# EAGLE schematic p8x-io-card (EAGLE 9.6.2)
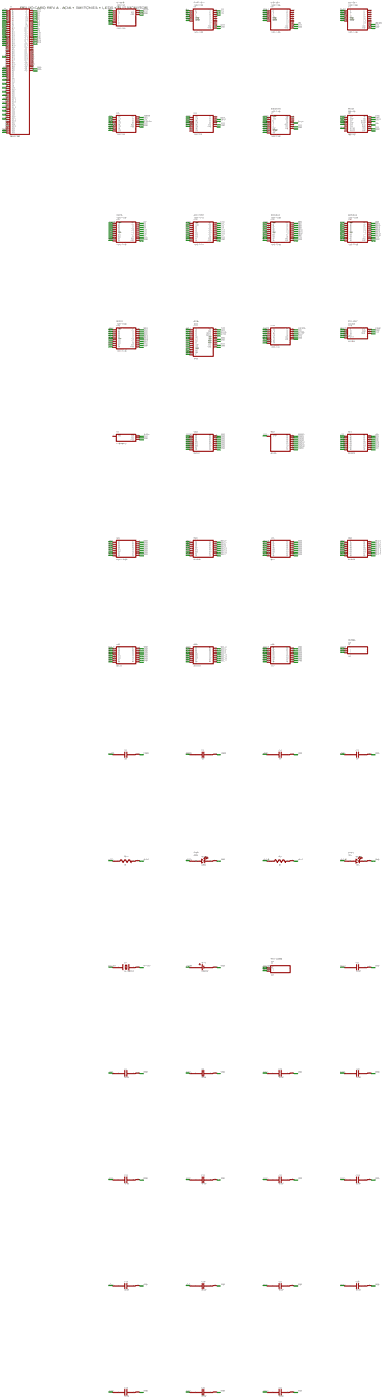
[diagram p0: schematic, sheet 1, overview]
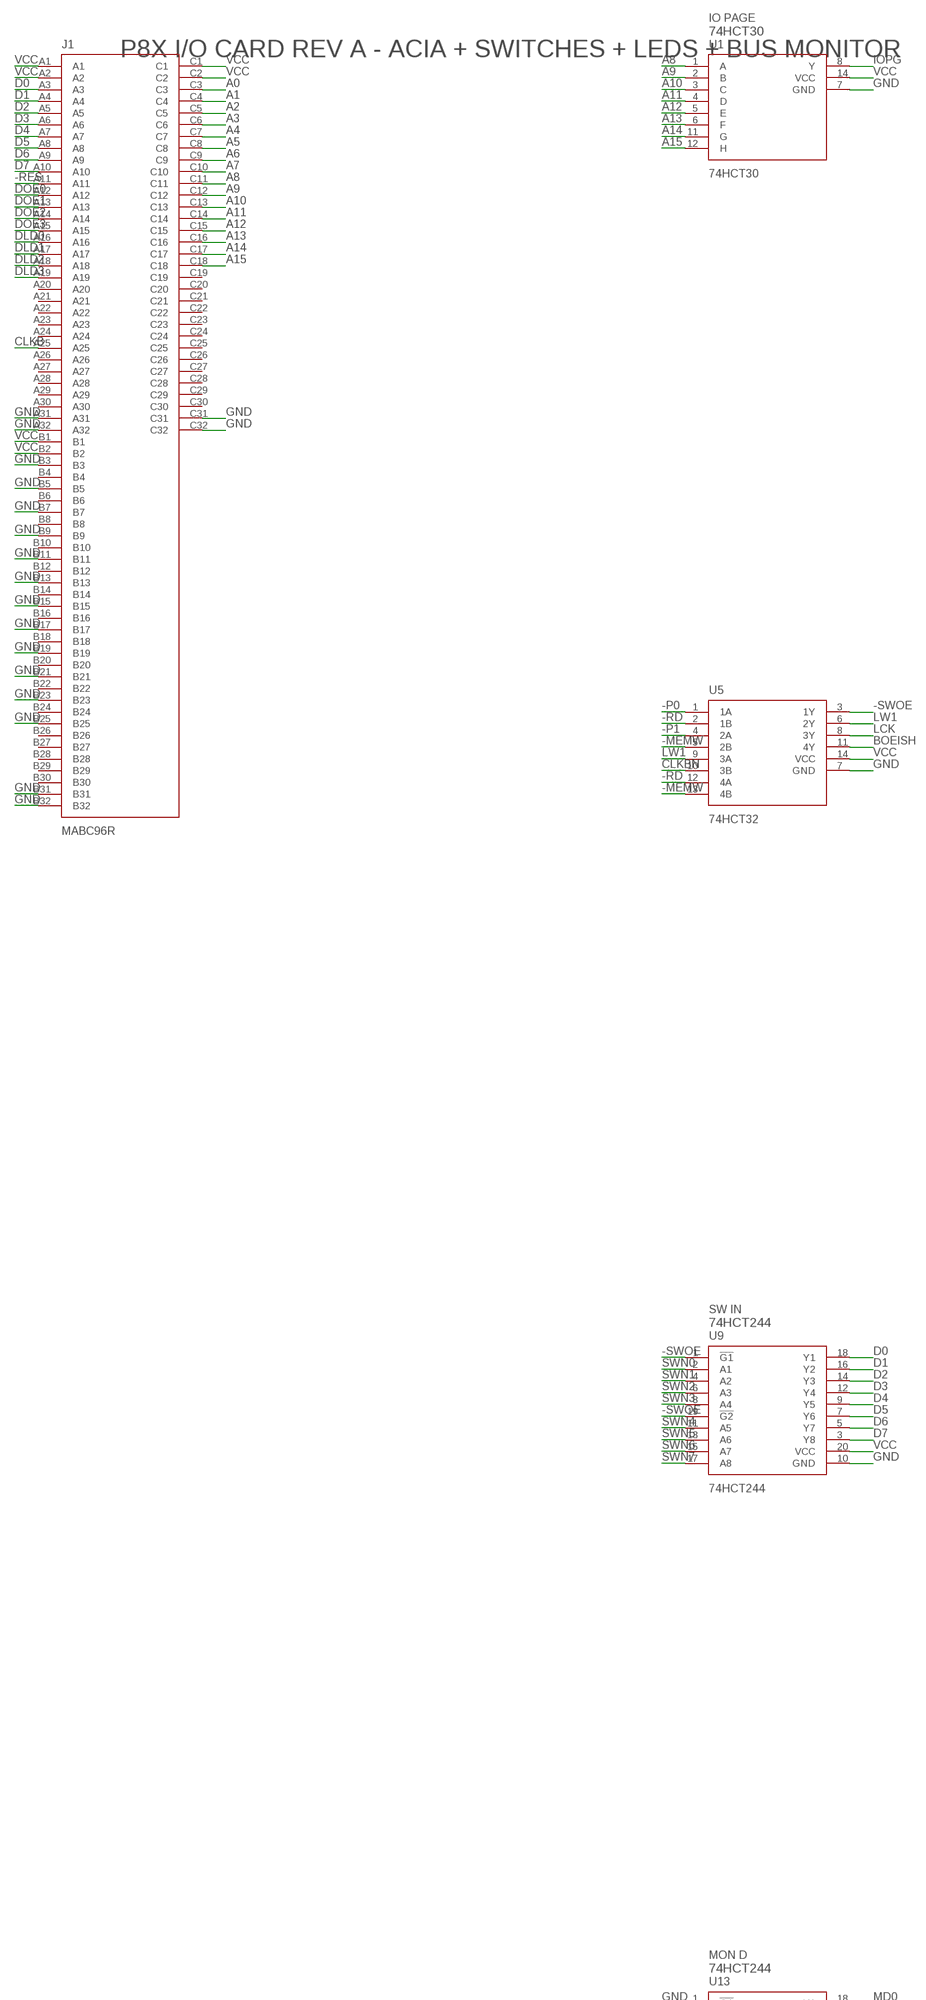
[diagram p1: schematic, sheet 1, part 1 of 5]
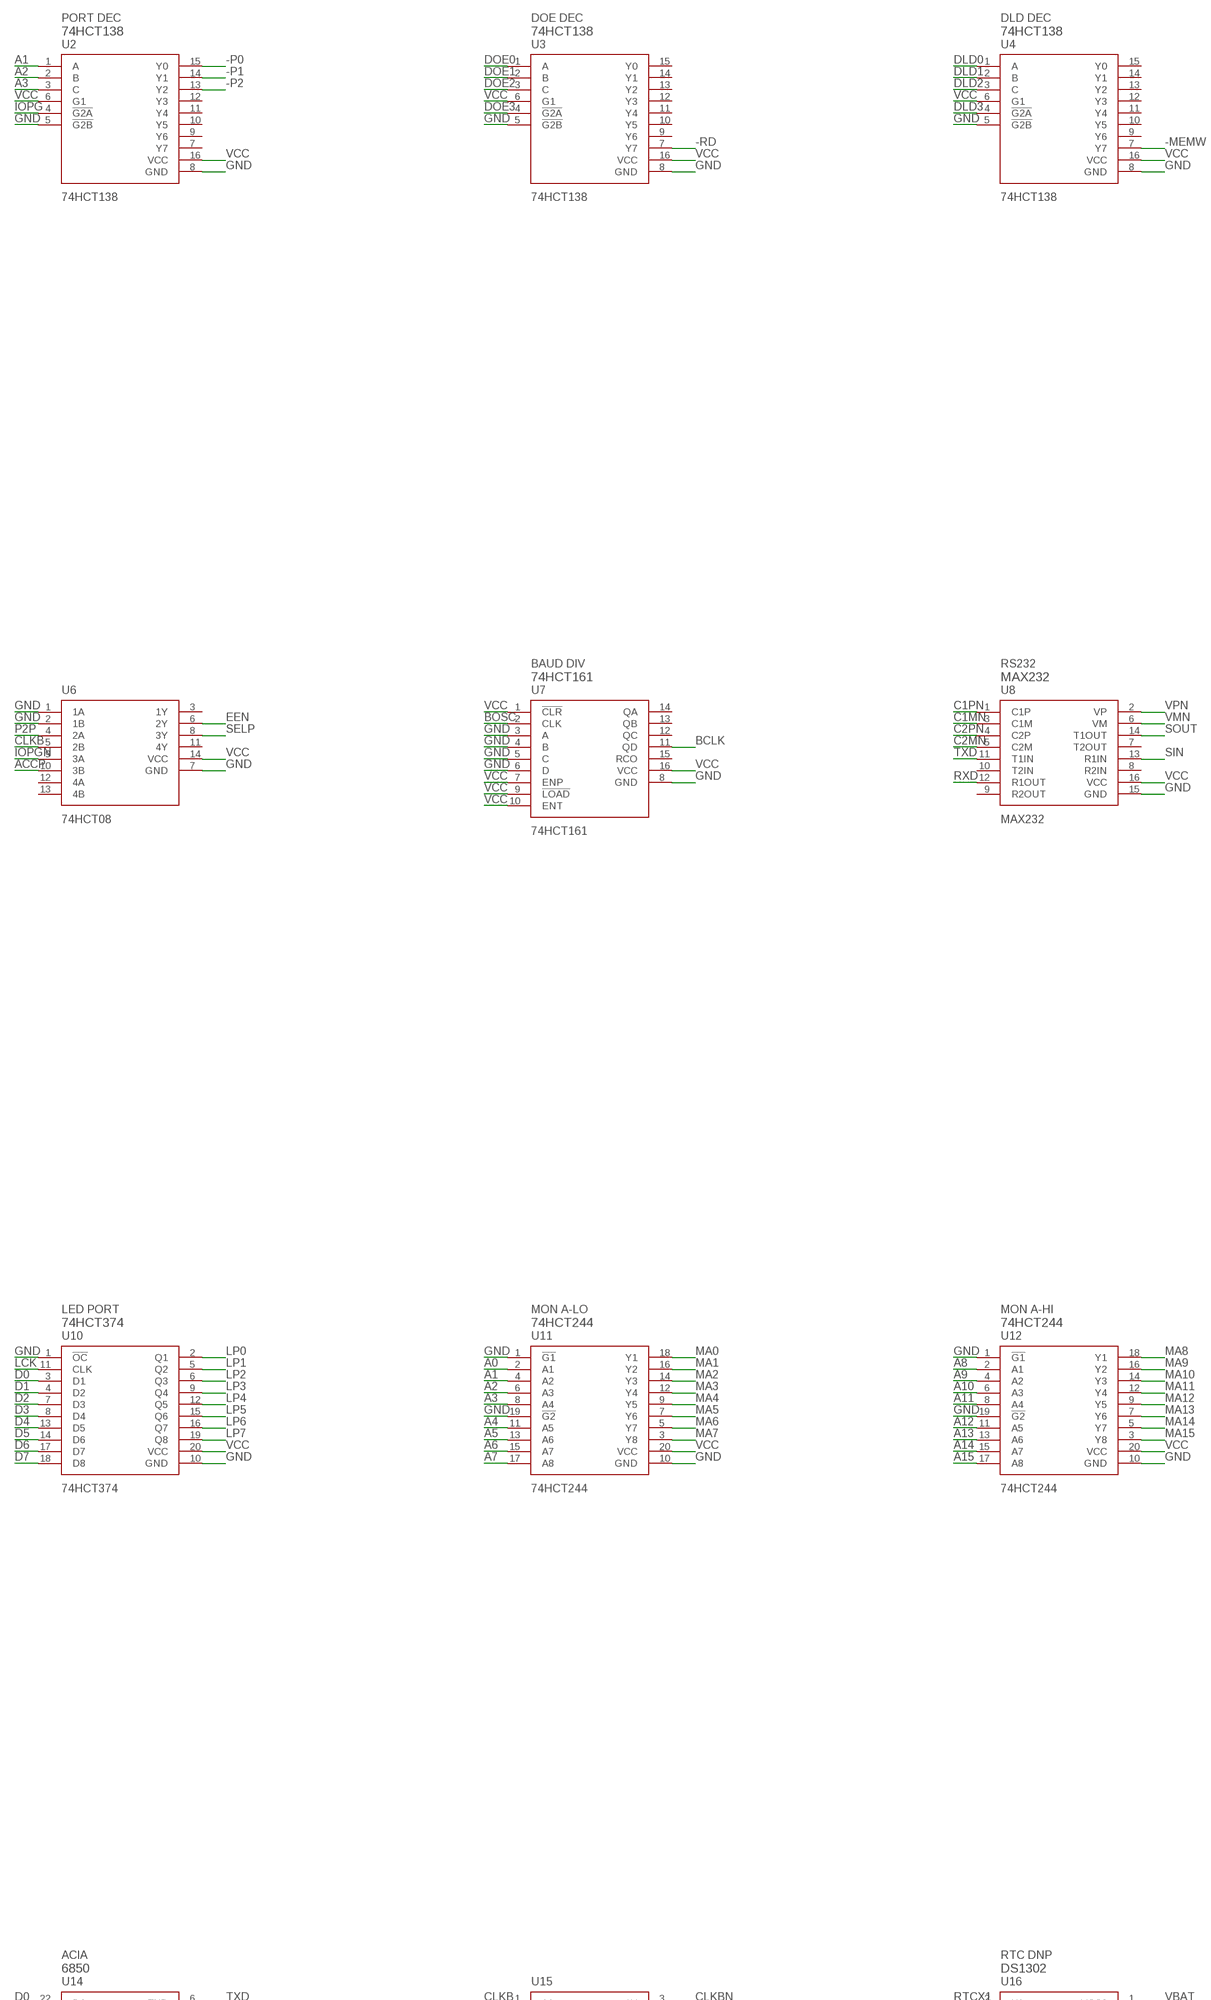
[diagram p2: schematic, sheet 1, part 2 of 5]
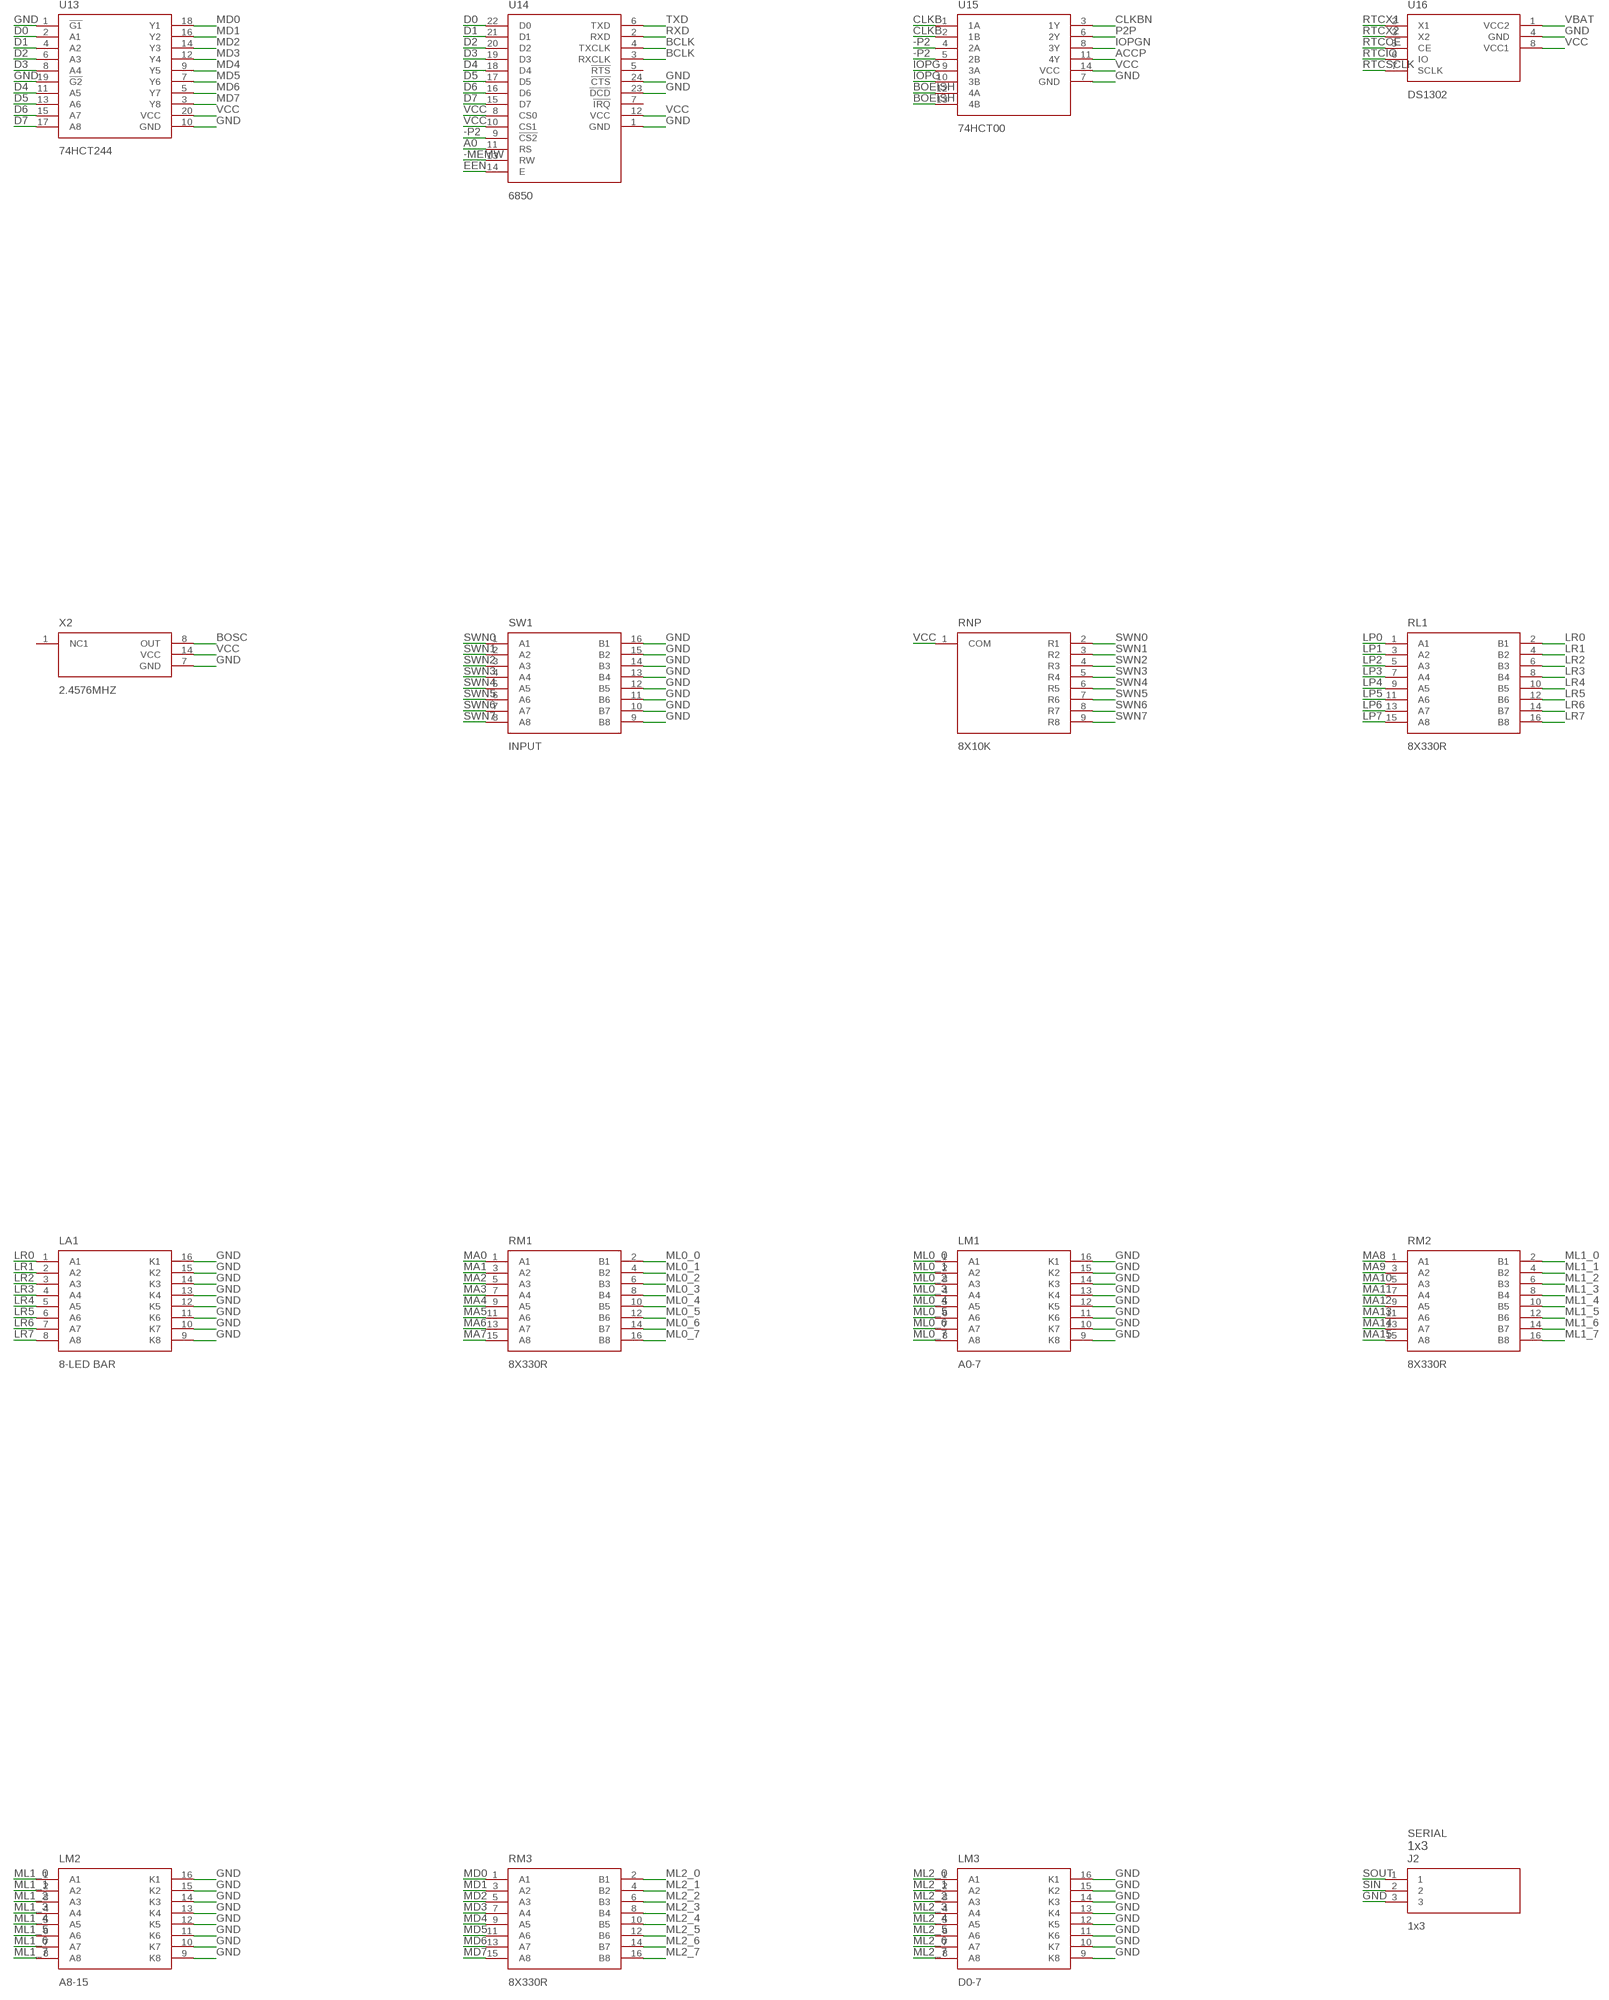
[diagram p3: schematic, sheet 1, part 3 of 5]
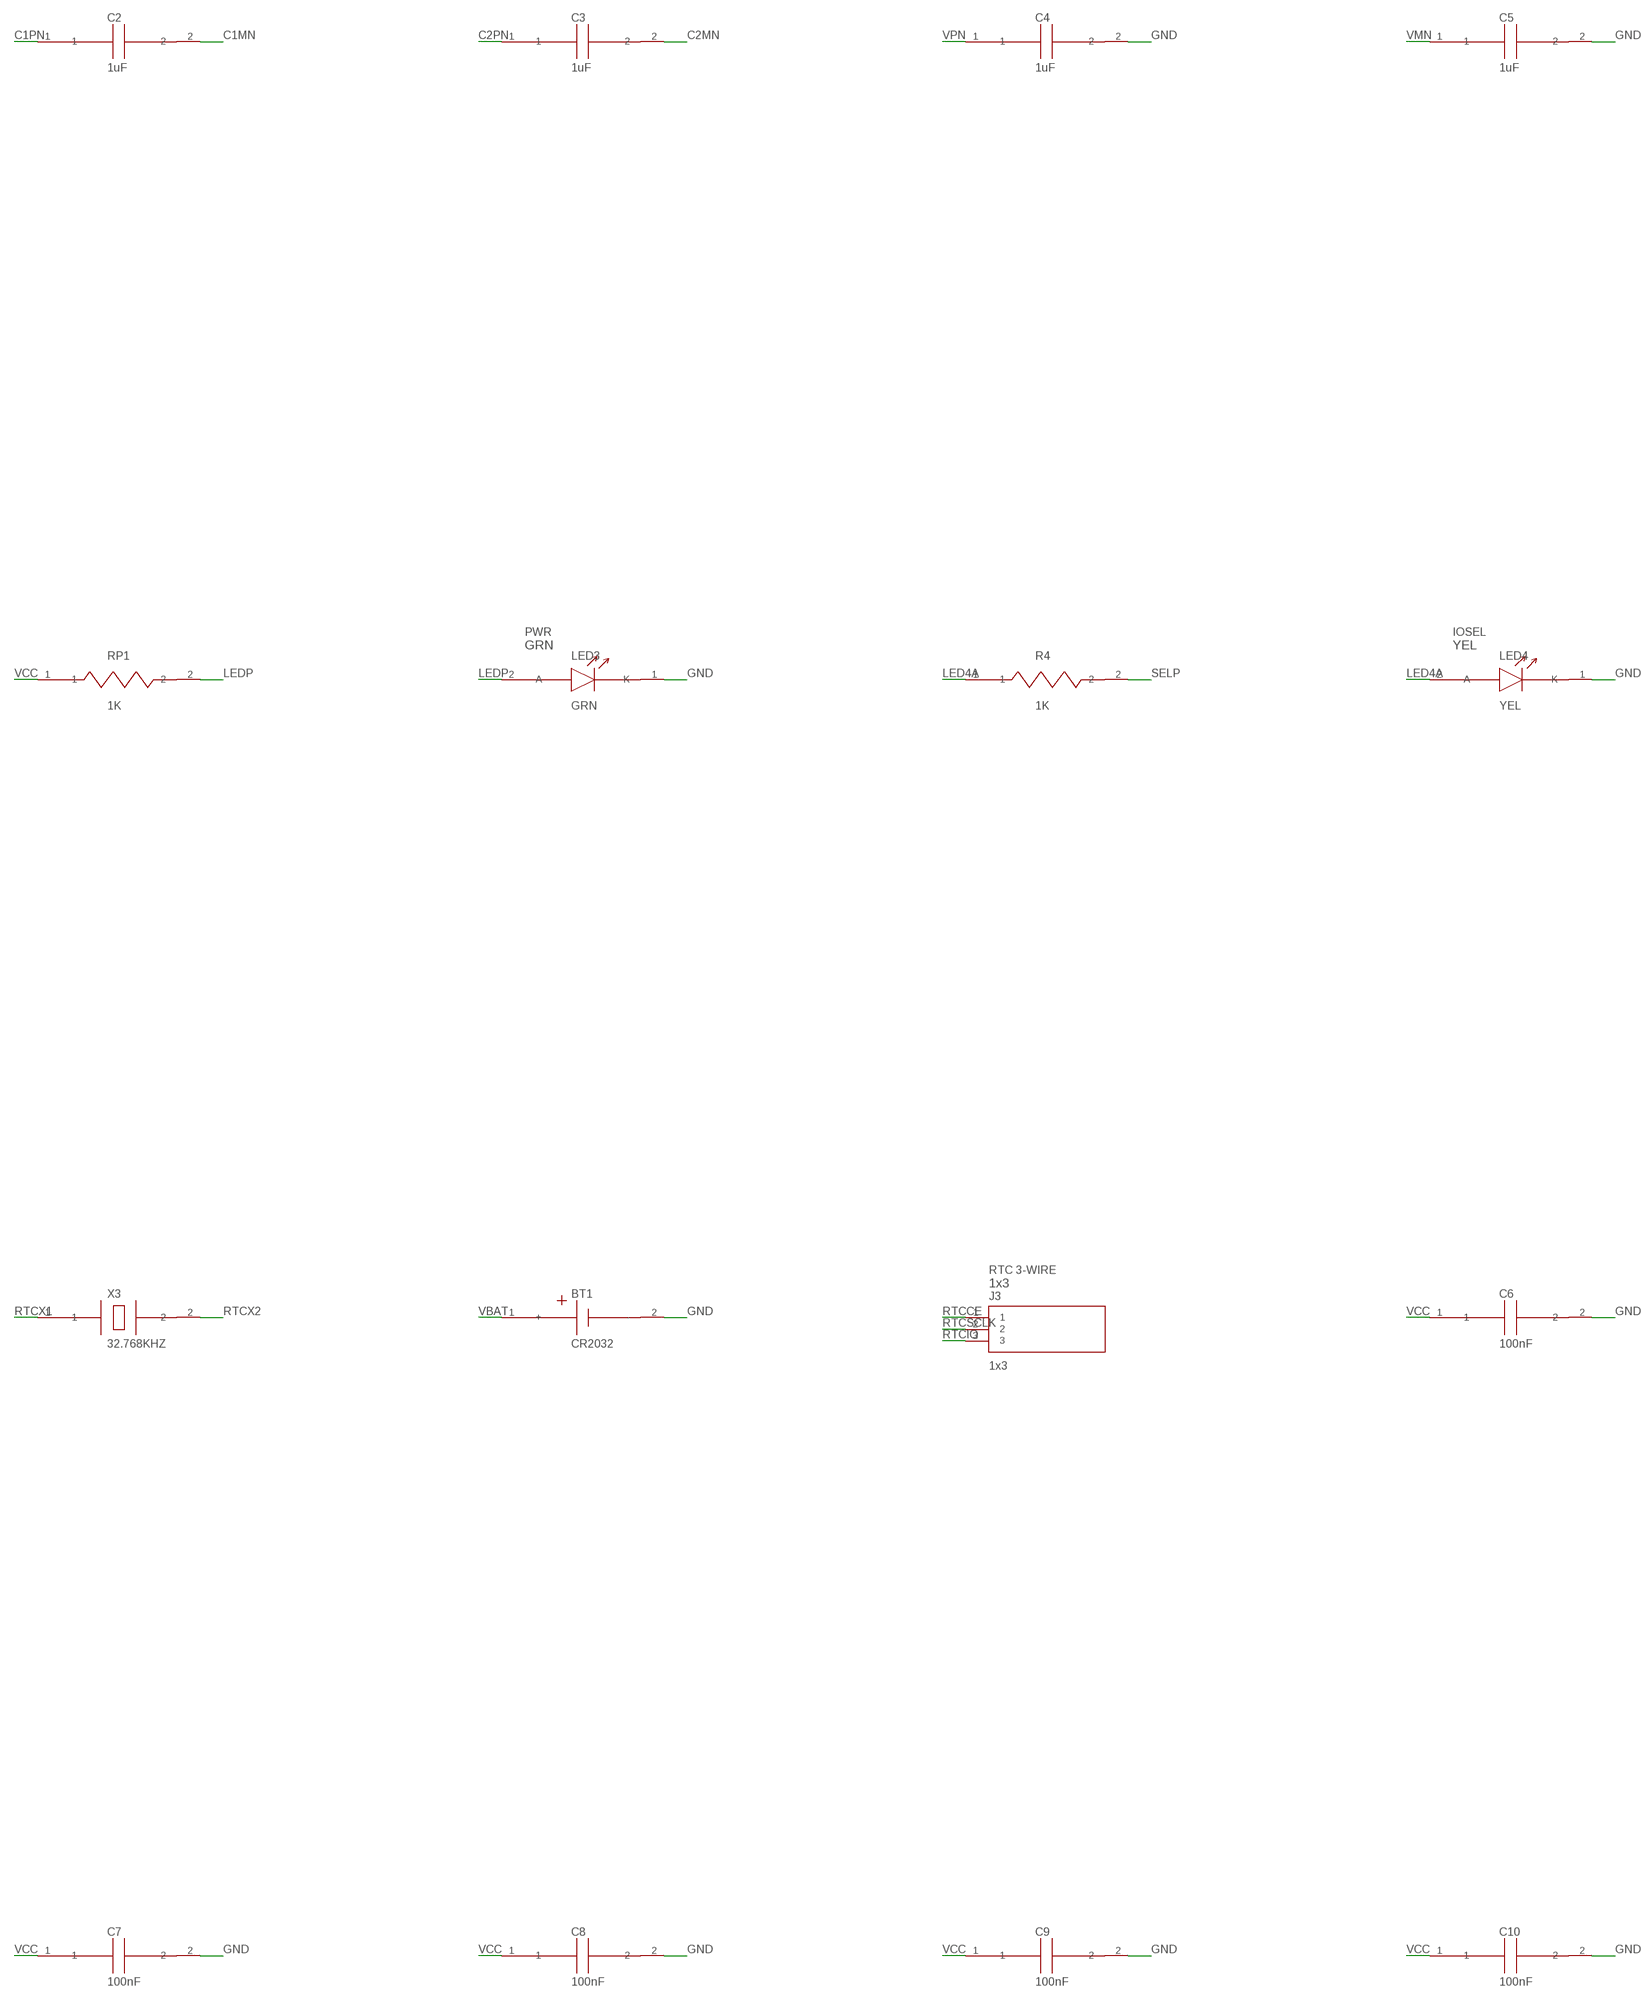
[diagram p4: schematic, sheet 1, part 4 of 5]
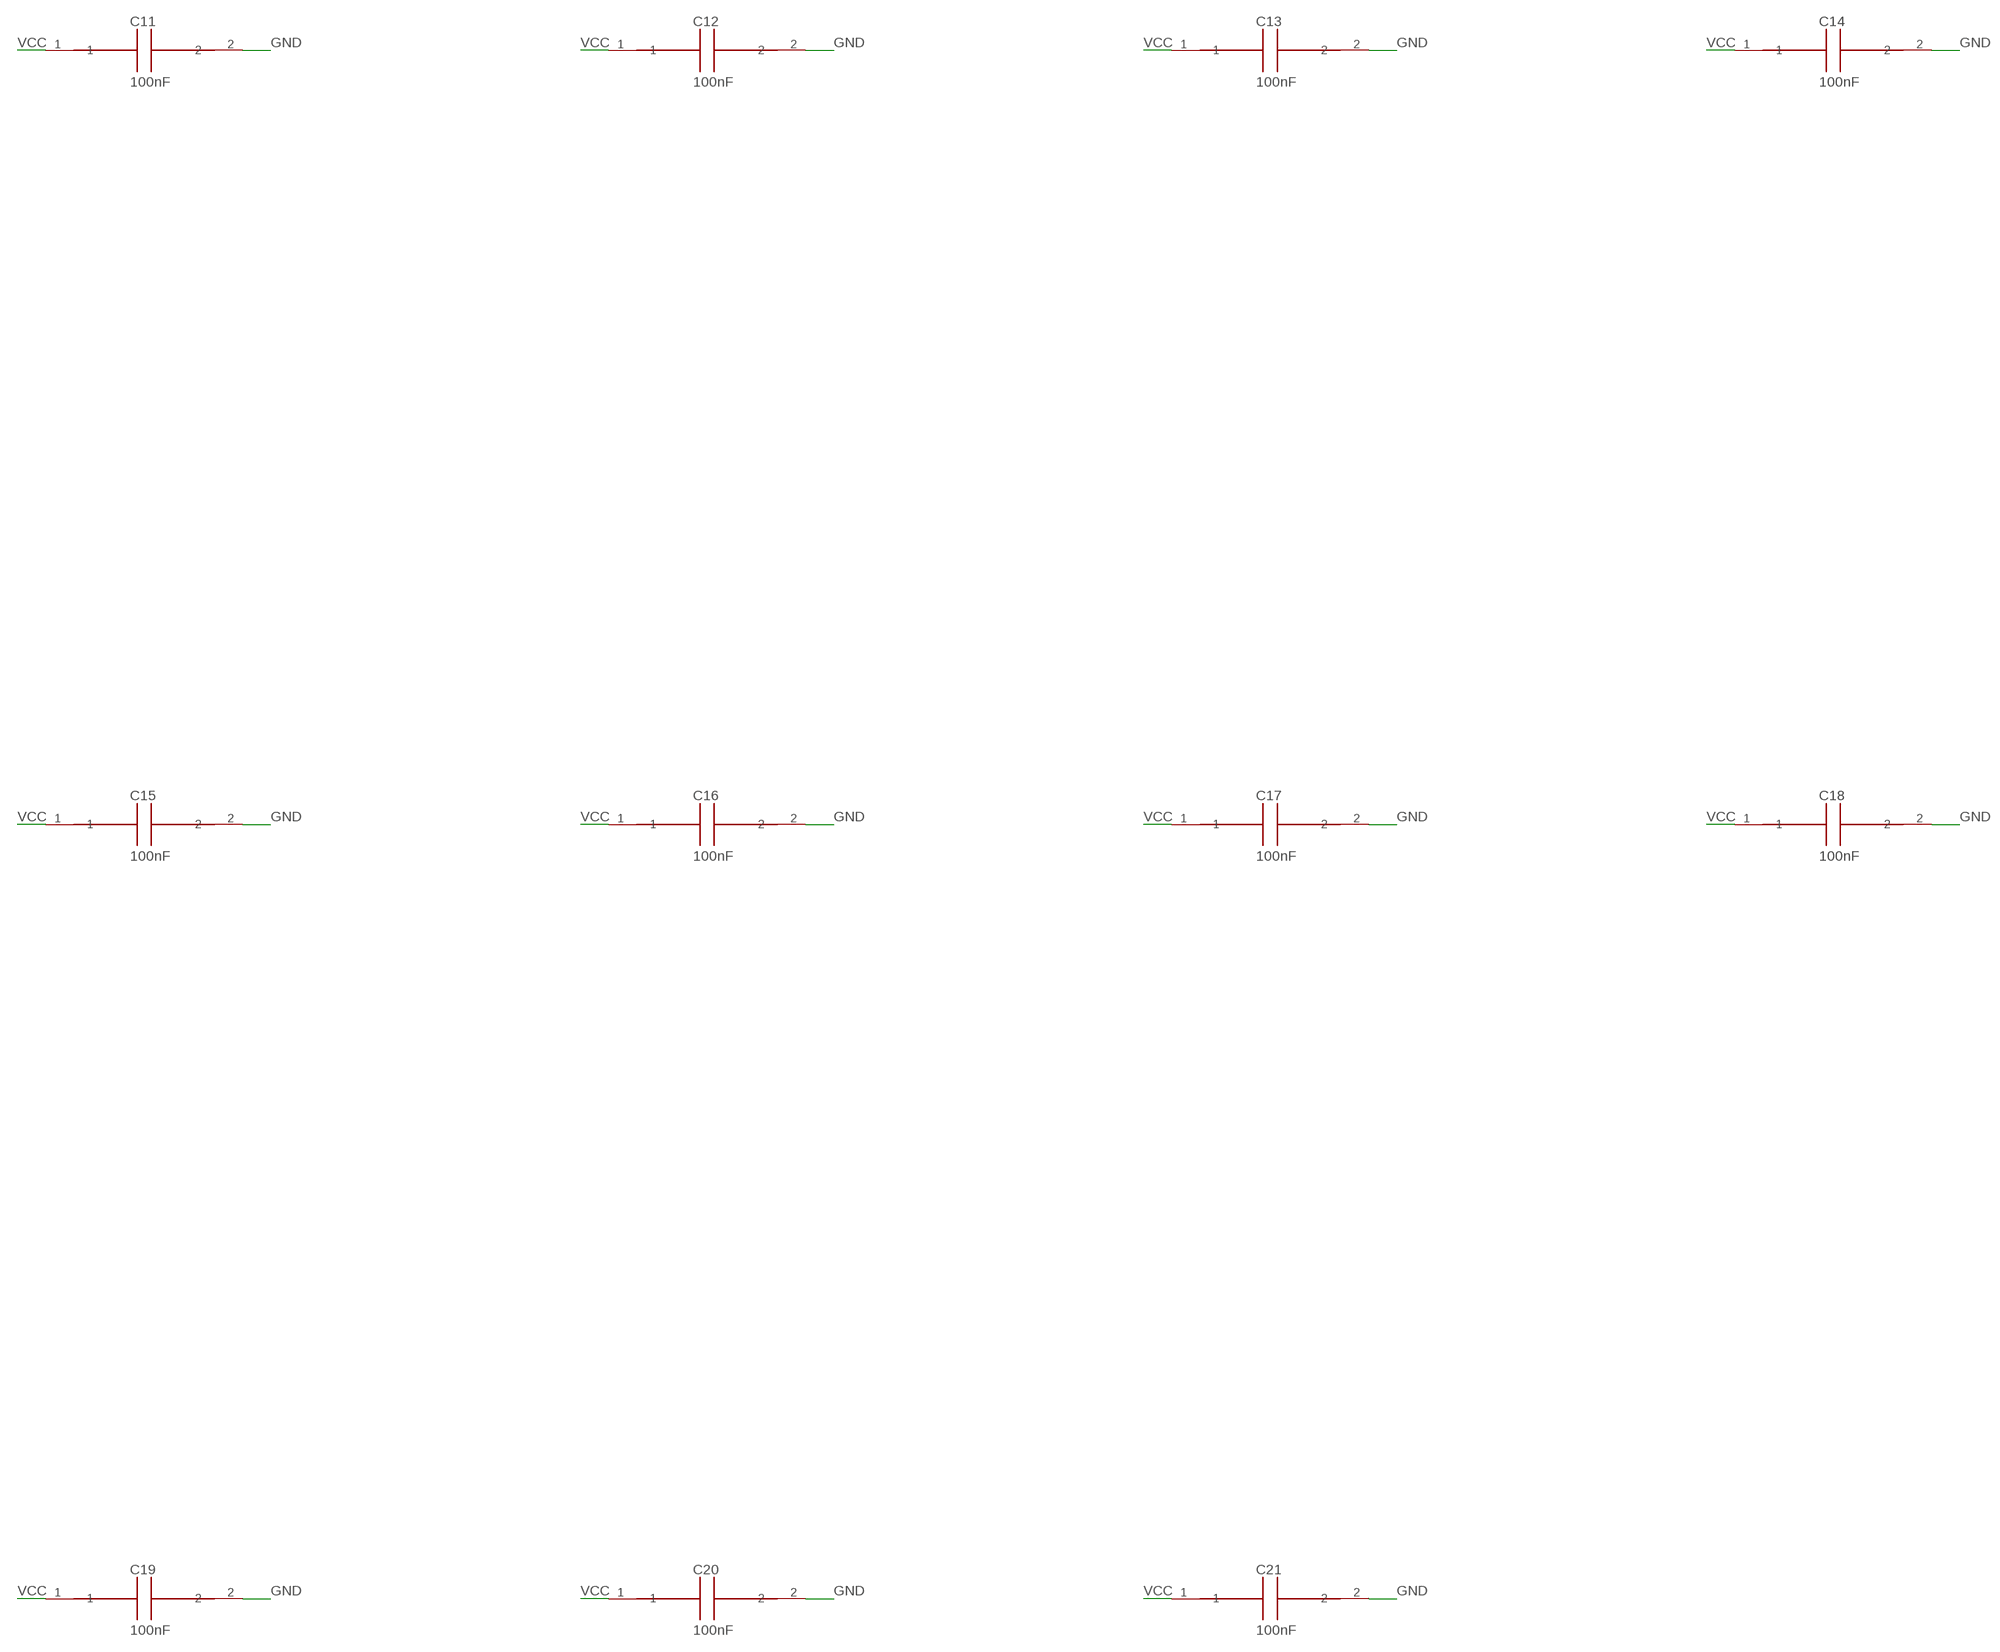
[diagram p5: schematic, sheet 1, part 5 of 5]

## Parts
BT1  CR2032  COIN  [CP_RADIAL]
C2  1uF  CAP  [C_DISC]
C3  1uF  CAP  [C_DISC]
C4  1uF  CAP  [C_DISC]
C5  1uF  CAP  [C_DISC]
C6  100nF  CAP1  [C_DISC1]
C7  100nF  CAP1  [C_DISC1]
C8  100nF  CAP1  [C_DISC1]
C9  100nF  CAP1  [C_DISC1]
C10  100nF  CAP1  [C_DISC1]
C11  100nF  CAP1  [C_DISC1]
C12  100nF  CAP1  [C_DISC1]
C13  100nF  CAP1  [C_DISC1]
C14  100nF  CAP1  [C_DISC1]
C15  100nF  CAP1  [C_DISC1]
C16  100nF  CAP1  [C_DISC1]
C17  100nF  CAP1  [C_DISC1]
C18  100nF  CAP1  [C_DISC1]
C19  100nF  CAP1  [C_DISC1]
C20  100nF  CAP1  [C_DISC1]
C21  100nF  CAP1  [C_DISC1]
J1  MABC96R  DIN96C  [MABC96R]
J2  1x3  HDR3  [HDR3]
J3  1x3  HDR3  [HDR3]
LA1  8-LED BAR  LEDARR8  [DIP16]
LED3  GRN  LED  [LED5]
LED4  YEL  LED  [LED5]
LM1  A0-7  LEDARR8  [DIP16]
LM2  A8-15  LEDARR8  [DIP16]
LM3  D0-7  LEDARR8  [DIP16]
R4  1K  RES  [R_AXIAL]
RL1  8X330R  RNISO8  [SIP16]
RM1  8X330R  RNISO8  [SIP16]
RM2  8X330R  RNISO8  [SIP16]
RM3  8X330R  RNISO8  [SIP16]
RNP  8X10K  SIP9  [SIP9]
RP1  1K  RES  [R_AXIAL]
SW1  INPUT  DIP8SW  [DIP16]
U1  74HCT30  7430  [DIP14]
U2  74HCT138  74138  [DIP16]
U3  74HCT138  74138  [DIP16]
U4  74HCT138  74138  [DIP16]
U5  74HCT32  GATES14  [DIP14]
U6  74HCT08  GATES14  [DIP14]
U7  74HCT161  74161  [DIP16]
U8  MAX232  [DIP16]
U9  74HCT244  74244  [DIP20]
U10  74HCT374  74374  [DIP20]
U11  74HCT244  74244  [DIP20]
U12  74HCT244  74244  [DIP20]
U13  74HCT244  74244  [DIP20]
U14  6850  [DIP24W]
U15  74HCT00  GATES14  [DIP14]
U16  DS1302  [DIP8]
X2  2.4576MHZ  OSC  [OSC4]
X3  32.768KHZ  XTAL32  [C_DISC]

## Nets
-MEMW: U4.7(Y7) U5.5(2B) U5.13(4B) U14.13(RW)
-P0: U2.15(Y0) U5.1(1A)
-P1: U2.14(Y1) U5.4(2A)
-P2: U2.13(Y2) U14.9(!CS2) U15.4(2A) U15.5(2B)
-RD: U3.7(Y7) U5.2(1B) U5.12(4A)
-RES: J1.A11
-SWOE: U5.3(1Y) U9.1(!G1) U9.19(!G2)
A0: J1.C3 U11.2(A1) U14.11(RS)
A1: J1.C4 U2.1(A) U11.4(A2)
A2: J1.C5 U2.2(B) U11.6(A3)
A3: J1.C6 U2.3(C) U11.8(A4)
A4: J1.C7 U11.11(A5)
A5: J1.C8 U11.13(A6)
A6: J1.C9 U11.15(A7)
A7: J1.C10 U11.17(A8)
A8: J1.C11 U1.1(A) U12.2(A1)
A9: J1.C12 U1.2(B) U12.4(A2)
A10: J1.C13 U1.3(C) U12.6(A3)
A11: J1.C14 U1.4(D) U12.8(A4)
A12: J1.C15 U1.5(E) U12.11(A5)
A13: J1.C16 U1.6(F) U12.13(A6)
A14: J1.C17 U1.11(G) U12.15(A7)
A15: J1.C18 U1.12(H) U12.17(A8)
ACCP: U6.10(3B) U15.11(4Y)
BCLK: U7.11(QD) U14.3(RXCLK) U14.4(TXCLK)
BOEISH: U5.11(4Y) U15.12(4A) U15.13(4B)
BOSC: U7.2(CLK) X2.8(OUT)
C1MN: C2.2 U8.3(C1M)
C1PN: C2.1 U8.1(C1P)
C2MN: C3.2 U8.5(C2M)
C2PN: C3.1 U8.4(C2P)
CLKB: J1.A25 U6.5(2B) U15.1(1A) U15.2(1B)
CLKBN: U5.10(3B) U15.3(1Y)
D0: J1.A3 U9.18(Y1) U10.3(D1) U13.2(A1) U14.22(D0)
D1: J1.A4 U9.16(Y2) U10.4(D2) U13.4(A2) U14.21(D1)
D2: J1.A5 U9.14(Y3) U10.7(D3) U13.6(A3) U14.20(D2)
D3: J1.A6 U9.12(Y4) U10.8(D4) U13.8(A4) U14.19(D3)
D4: J1.A7 U9.9(Y5) U10.13(D5) U13.11(A5) U14.18(D4)
D5: J1.A8 U9.7(Y6) U10.14(D6) U13.13(A6) U14.17(D5)
D6: J1.A9 U9.5(Y7) U10.17(D7) U13.15(A7) U14.16(D6)
D7: J1.A10 U9.3(Y8) U10.18(D8) U13.17(A8) U14.15(D7)
DLD0: J1.A16 U4.1(A)
DLD1: J1.A17 U4.2(B)
DLD2: J1.A18 U4.3(C)
DLD3: J1.A19 U4.4(!G2A)
DOE0: J1.A12 U3.1(A)
DOE1: J1.A13 U3.2(B)
DOE2: J1.A14 U3.3(C)
DOE3: J1.A15 U3.4(!G2A)
EEN: U6.6(2Y) U14.14(E)
GND: BT1.2(-) C4.2 C5.2 C6.2 C7.2 C8.2 C9.2 C10.2 C11.2 C12.2 C13.2 C14.2 C15.2 C16.2 C17.2 C18.2 C19.2 C20.2 C21.2 J1.A31 J1.A32 J1.B3 J1.B5 J1.B7 J1.B9 J1.B11 J1.B13 J1.B15 J1.B17 J1.B19 J1.B21 J1.B23 J1.B25 J1.B31 J1.B32 J1.C31 J1.C32 J2.3 LA1.9(K8) LA1.10(K7) LA1.11(K6) LA1.12(K5) LA1.13(K4) LA1.14(K3) LA1.15(K2) LA1.16(K1) LED3.1(K) LED4.1(K) LM1.9(K8) LM1.10(K7) LM1.11(K6) LM1.12(K5) LM1.13(K4) LM1.14(K3) LM1.15(K2) LM1.16(K1) LM2.9(K8) LM2.10(K7) LM2.11(K6) LM2.12(K5) LM2.13(K4) LM2.14(K3) LM2.15(K2) LM2.16(K1) LM3.9(K8) LM3.10(K7) LM3.11(K6) LM3.12(K5) LM3.13(K4) LM3.14(K3) LM3.15(K2) LM3.16(K1) SW1.9(B8) SW1.10(B7) SW1.11(B6) SW1.12(B5) SW1.13(B4) SW1.14(B3) SW1.15(B2) SW1.16(B1) U1.7(GND) U2.5(!G2B) U2.8(GND) U3.5(!G2B) U3.8(GND) U4.5(!G2B) U4.8(GND) U5.7(GND) U6.1(1A) U6.2(1B) U6.7(GND) U7.3(A) U7.4(B) U7.5(C) U7.6(D) U7.8(GND) U8.15(GND) U9.10(GND) U10.1(!OC) U10.10(GND) U11.1(!G1) U11.10(GND) U11.19(!G2) U12.1(!G1) U12.10(GND) U12.19(!G2) U13.1(!G1) U13.10(GND) U13.19(!G2) U14.1(GND) U14.23(!DCD) U14.24(!CTS) U15.7(GND) U16.4(GND) X2.7(GND)
IOPG: U1.8(Y) U2.4(!G2A) U15.9(3A) U15.10(3B)
IOPGN: U6.9(3A) U15.8(3Y)
LCK: U5.8(3Y) U10.11(CLK)
LED4A: LED4.2(A) R4.1
LEDP: LED3.2(A) RP1.2
LP0: RL1.1(A1) U10.2(Q1)
LP1: RL1.3(A2) U10.5(Q2)
LP2: RL1.5(A3) U10.6(Q3)
LP3: RL1.7(A4) U10.9(Q4)
LP4: RL1.9(A5) U10.12(Q5)
LP5: RL1.11(A6) U10.15(Q6)
LP6: RL1.13(A7) U10.16(Q7)
LP7: RL1.15(A8) U10.19(Q8)
LR0: LA1.1(A1) RL1.2(B1)
LR1: LA1.2(A2) RL1.4(B2)
LR2: LA1.3(A3) RL1.6(B3)
LR3: LA1.4(A4) RL1.8(B4)
LR4: LA1.5(A5) RL1.10(B5)
LR5: LA1.6(A6) RL1.12(B6)
LR6: LA1.7(A7) RL1.14(B7)
LR7: LA1.8(A8) RL1.16(B8)
LW1: U5.6(2Y) U5.9(3A)
MA0: RM1.1(A1) U11.18(Y1)
MA1: RM1.3(A2) U11.16(Y2)
MA2: RM1.5(A3) U11.14(Y3)
MA3: RM1.7(A4) U11.12(Y4)
MA4: RM1.9(A5) U11.9(Y5)
MA5: RM1.11(A6) U11.7(Y6)
MA6: RM1.13(A7) U11.5(Y7)
MA7: RM1.15(A8) U11.3(Y8)
MA8: RM2.1(A1) U12.18(Y1)
MA9: RM2.3(A2) U12.16(Y2)
MA10: RM2.5(A3) U12.14(Y3)
MA11: RM2.7(A4) U12.12(Y4)
MA12: RM2.9(A5) U12.9(Y5)
MA13: RM2.11(A6) U12.7(Y6)
MA14: RM2.13(A7) U12.5(Y7)
MA15: RM2.15(A8) U12.3(Y8)
MD0: RM3.1(A1) U13.18(Y1)
MD1: RM3.3(A2) U13.16(Y2)
MD2: RM3.5(A3) U13.14(Y3)
MD3: RM3.7(A4) U13.12(Y4)
MD4: RM3.9(A5) U13.9(Y5)
MD5: RM3.11(A6) U13.7(Y6)
MD6: RM3.13(A7) U13.5(Y7)
MD7: RM3.15(A8) U13.3(Y8)
ML0_0: LM1.1(A1) RM1.2(B1)
ML0_1: LM1.2(A2) RM1.4(B2)
ML0_2: LM1.3(A3) RM1.6(B3)
ML0_3: LM1.4(A4) RM1.8(B4)
ML0_4: LM1.5(A5) RM1.10(B5)
ML0_5: LM1.6(A6) RM1.12(B6)
ML0_6: LM1.7(A7) RM1.14(B7)
ML0_7: LM1.8(A8) RM1.16(B8)
ML1_0: LM2.1(A1) RM2.2(B1)
ML1_1: LM2.2(A2) RM2.4(B2)
ML1_2: LM2.3(A3) RM2.6(B3)
ML1_3: LM2.4(A4) RM2.8(B4)
ML1_4: LM2.5(A5) RM2.10(B5)
ML1_5: LM2.6(A6) RM2.12(B6)
ML1_6: LM2.7(A7) RM2.14(B7)
ML1_7: LM2.8(A8) RM2.16(B8)
ML2_0: LM3.1(A1) RM3.2(B1)
ML2_1: LM3.2(A2) RM3.4(B2)
ML2_2: LM3.3(A3) RM3.6(B3)
ML2_3: LM3.4(A4) RM3.8(B4)
ML2_4: LM3.5(A5) RM3.10(B5)
ML2_5: LM3.6(A6) RM3.12(B6)
ML2_6: LM3.7(A7) RM3.14(B7)
ML2_7: LM3.8(A8) RM3.16(B8)
P2P: U6.4(2A) U15.6(2Y)
RTCCE: J3.1 U16.5(CE)
RTCIO: J3.3 U16.6(IO)
RTCSCLK: J3.2 U16.7(SCLK)
RTCX1: U16.2(X1) X3.1
RTCX2: U16.3(X2) X3.2
RXD: U8.12(R1OUT) U14.2(RXD)
SELP: R4.2 U6.8(3Y)
SIN: J2.2 U8.13(R1IN)
SOUT: J2.1 U8.14(T1OUT)
SWN0: RNP.2(R1) SW1.1(A1) U9.2(A1)
SWN1: RNP.3(R2) SW1.2(A2) U9.4(A2)
SWN2: RNP.4(R3) SW1.3(A3) U9.6(A3)
SWN3: RNP.5(R4) SW1.4(A4) U9.8(A4)
SWN4: RNP.6(R5) SW1.5(A5) U9.11(A5)
SWN5: RNP.7(R6) SW1.6(A6) U9.13(A6)
SWN6: RNP.8(R7) SW1.7(A7) U9.15(A7)
SWN7: RNP.9(R8) SW1.8(A8) U9.17(A8)
TXD: U8.11(T1IN) U14.6(TXD)
VBAT: BT1.1(+) U16.1(VCC2)
VCC: C6.1 C7.1 C8.1 C9.1 C10.1 C11.1 C12.1 C13.1 C14.1 C15.1 C16.1 C17.1 C18.1 C19.1 C20.1 C21.1 J1.A1 J1.A2 J1.B1 J1.B2 J1.C1 J1.C2 RNP.1(COM) RP1.1 U1.14(VCC) U2.6(G1) U2.16(VCC) U3.6(G1) U3.16(VCC) U4.6(G1) U4.16(VCC) U5.14(VCC) U6.14(VCC) U7.1(!CLR) U7.7(ENP) U7.9(!LOAD) U7.10(ENT) U7.16(VCC) U8.16(VCC) U9.20(VCC) U10.20(VCC) U11.20(VCC) U12.20(VCC) U13.20(VCC) U14.8(CS0) U14.10(CS1) U14.12(VCC) U15.14(VCC) U16.8(VCC1) X2.14(VCC)
VMN: C5.1 U8.6(VM)
VPN: C4.1 U8.2(VP)
Unconnected: J1.A20 J1.A21 J1.A22 J1.A23 J1.A24 J1.A26 J1.A27 J1.A28 J1.A29 J1.A30 J1.B4 J1.B6 J1.B8 J1.B10 J1.B12 J1.B14 J1.B16 J1.B18 J1.B20 J1.B22 J1.B24 J1.B26 J1.B27 J1.B28 J1.B29 J1.B30 J1.C19 J1.C20 J1.C21 J1.C22 J1.C23 J1.C24 J1.C25 J1.C26 J1.C27 J1.C28 J1.C29 J1.C30 U2.7(Y7) U2.9(Y6) U2.10(Y5) U2.11(Y4) U2.12(Y3) U3.9(Y6) U3.10(Y5) U3.11(Y4) U3.12(Y3) U3.13(Y2) U3.14(Y1) U3.15(Y0) U4.9(Y6) U4.10(Y5) U4.11(Y4) U4.12(Y3) U4.13(Y2) U4.14(Y1) U4.15(Y0) U6.3(1Y) U6.11(4Y) U6.12(4A) U6.13(4B) U7.12(QC) U7.13(QB) U7.14(QA) U7.15(RCO) U8.7(T2OUT) U8.8(R2IN) U8.9(R2OUT) U8.10(T2IN) U14.5(!RTS) U14.7(!IRQ) X2.1(NC1)

## Notes on the sheet
- IO PAGE | PORT DEC | DOE DEC | DLD DEC
- 74HCT30 | 74HCT138 | 74HCT138 | 74HCT138
- P8X I/O CARD REV A - ACIA + SWITCHES + LEDS + BUS MONITOR
- BAUD DIV | RS232
- 74HCT161 | MAX232
- SW IN | LED PORT | MON A-LO | MON A-HI
- 74HCT244 | 74HCT374 | 74HCT244 | 74HCT244
- MON D | ACIA | RTC DNP
- 74HCT244 | 6850 | DS1302
- SERIAL
- 1x3
- PWR | IOSEL
- GRN | YEL
- RTC 3-WIRE
- 1x3

## Library data of the parts
BT1 = p8x:COIN
C2-C5 = p8x:CAP
C6-C21 = p8x:CAP1
J1 = p8x:DIN96C
J2 J3 = p8x:HDR3
LA1 LM1-LM3 = p8x:LEDARR8
LED3 LED4 = p8x:LED
R4 RP1 = p8x:RES
RL1 RM1-RM3 = p8x:RNISO8
RNP = p8x:SIP9
SW1 = p8x:DIP8SW
U1 = p8x:7430
U2-U4 = p8x:74138
U5 U6 U15 = p8x:GATES14
U7 = p8x:74161
U8 = p8x:MAX232
U9 U11-U13 = p8x:74244
U10 = p8x:74374
U14 = p8x:6850
U16 = p8x:DS1302
X2 = p8x:OSC
X3 = p8x:XTAL32